# EAGLE schematic bc29_replacement (EAGLE 7.7.0)

## Sheet 1 of 5
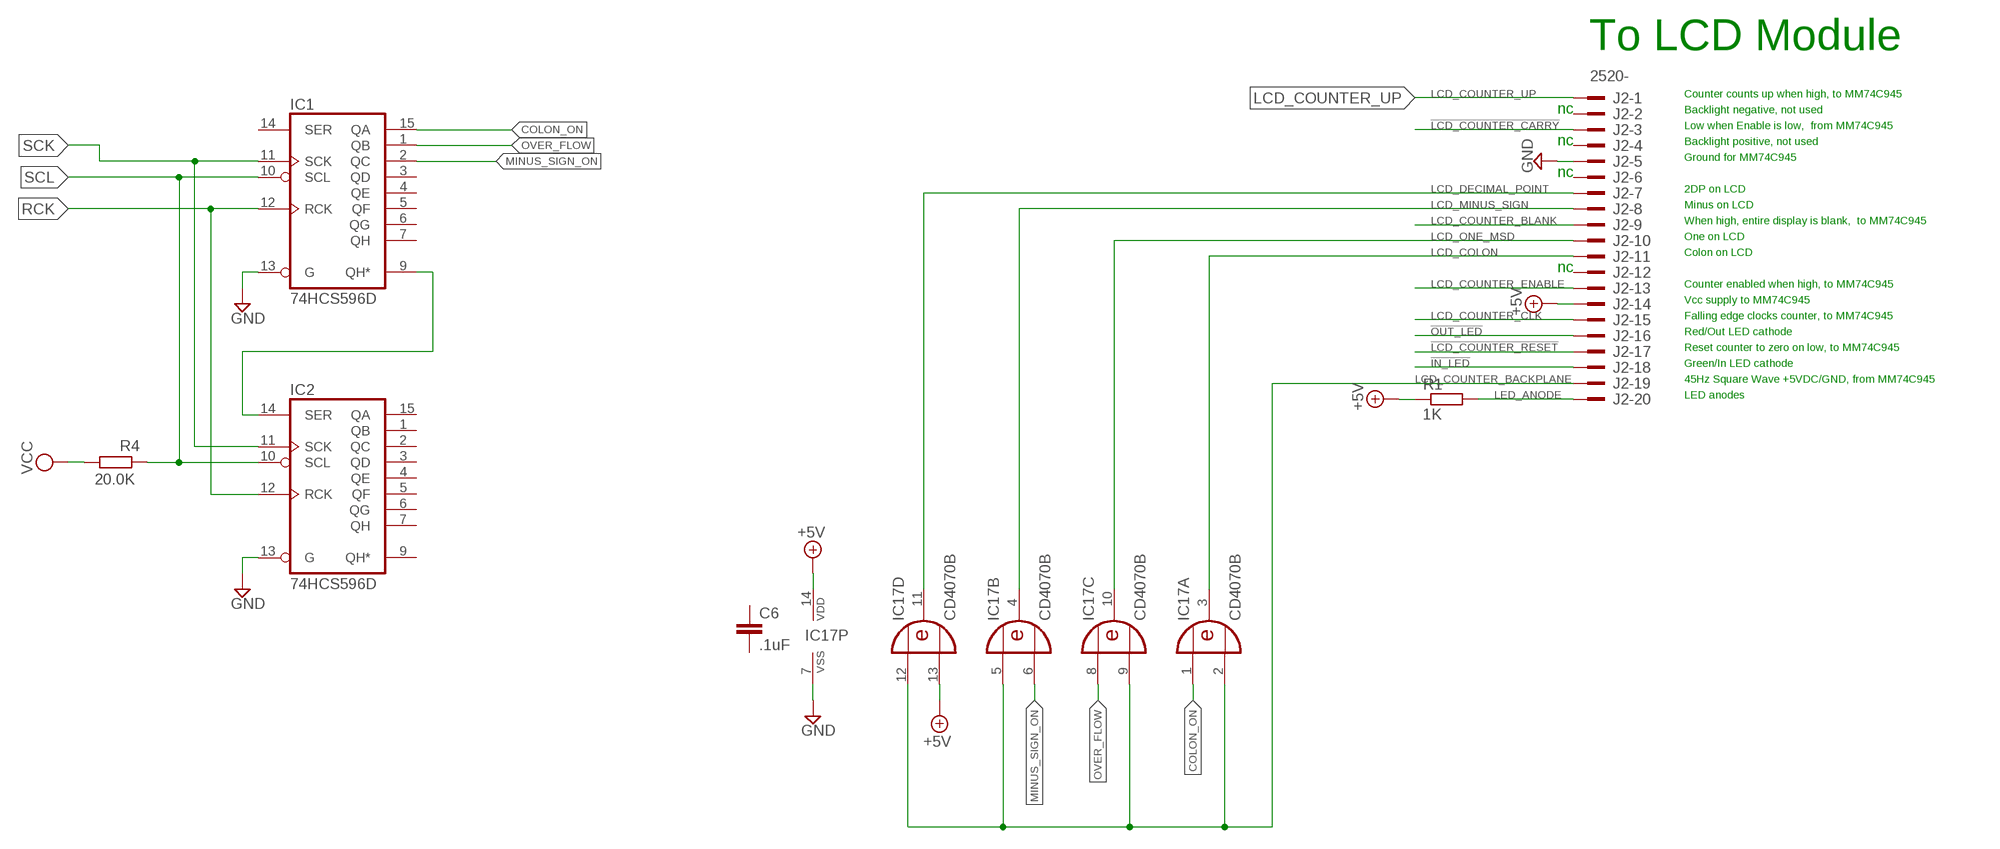
[diagram p0: schematic, sheet 1]

### Parts
C6  .1uF  C-EUC0805  [C0805]
IC1  74HCS596D  74LS596D  [SO16]
IC2  74HCS596D  74LS596D  [SO16]
IC17  CD4070B  4070D  [SO14]
J2  2520-  [PAK100/2500-20]
R1  1K  R-EU_R0805  [R0805]
R4  20.0K  R-EU_R0805  [R0805]

### Nets
!IN_LED: J2.18
!LCD_COUNTER_CARRY: J2.3
!LCD_COUNTER_RESET: J2.17
!OUT_LED: J2.16
+5V: IC17.13(D:I1) J2.14 R1.1 ; also sheet 3
+12V: IC17.14(P:VDD) ; supply symbol labelled +5V
COLON_ON: IC17.1(A:I0)
GND: IC1.13(G) IC2.13(G) IC17.7(P:VSS) J2.5 ; also sheet 2,3,4,5
LCD_COLON: IC17.3(A:O) J2.11
LCD_COUNTER_BACKPLANE: IC17.2(A:I1) IC17.5(B:I0) IC17.9(C:I1) IC17.12(D:I0) J2.19
LCD_COUNTER_BLANK: J2.9
LCD_COUNTER_CLK: J2.15
LCD_COUNTER_ENABLE: J2.13
LCD_COUNTER_UP: J2.1
LCD_DECIMAL_POINT: IC17.11(D:O) J2.7
LCD_MINUS_SIGN: IC17.4(B:O) J2.8
LCD_ONE_MSD: IC17.10(C:O) J2.10
LED_ANODE: J2.20 R1.2
MINUS_SIGN_ON: IC17.6(B:I1)
N$4: IC1.9(QH*) IC2.14(SER)
OVER_FLOW: IC17.8(C:I0)
RCK: IC1.12(RCK) IC2.12(RCK)
SCK: IC1.11(SCK) IC2.11(SCK)
SCL: IC1.10(SCL) IC2.10(SCL) R4.1
VCC: R4.2 ; also sheet 2
Unconnected: C6.1 C6.2 IC1.1(QB) IC1.2(QC) IC1.3(QD) IC1.4(QE) IC1.5(QF) IC1.6(QG) IC1.7(QH) IC1.14(SER) IC1.15(QA) IC2.1(QB) IC2.2(QC) IC2.3(QD) IC2.4(QE) IC2.5(QF) IC2.6(QG) IC2.7(QH) IC2.9(QH*) IC2.15(QA) J2.2 J2.4 J2.6 J2.12

### Notes on the sheet
- To LCD Module
- Counter counts up when high, to MM74C945
- nc | Backlight negative, not used
- Low when Enable is low,  from MM74C945
- nc | Backlight positive, not used
- Ground for MM74C945
- nc
- 2DP on LCD
- Minus on LCD
- When high, entire display is blank,  to MM74C945
- One on LCD
- Colon on LCD
- nc
- Counter enabled when high, to MM74C945
- Vcc supply to MM74C945
- Falling edge clocks counter, to MM74C945
- Red/Out LED cathode
- Reset counter to zero on low, to MM74C945
- Green/In LED cathode
- 45Hz Square Wave +5VDC/GND, from MM74C945
- LED anodes

## Sheet 2 of 5
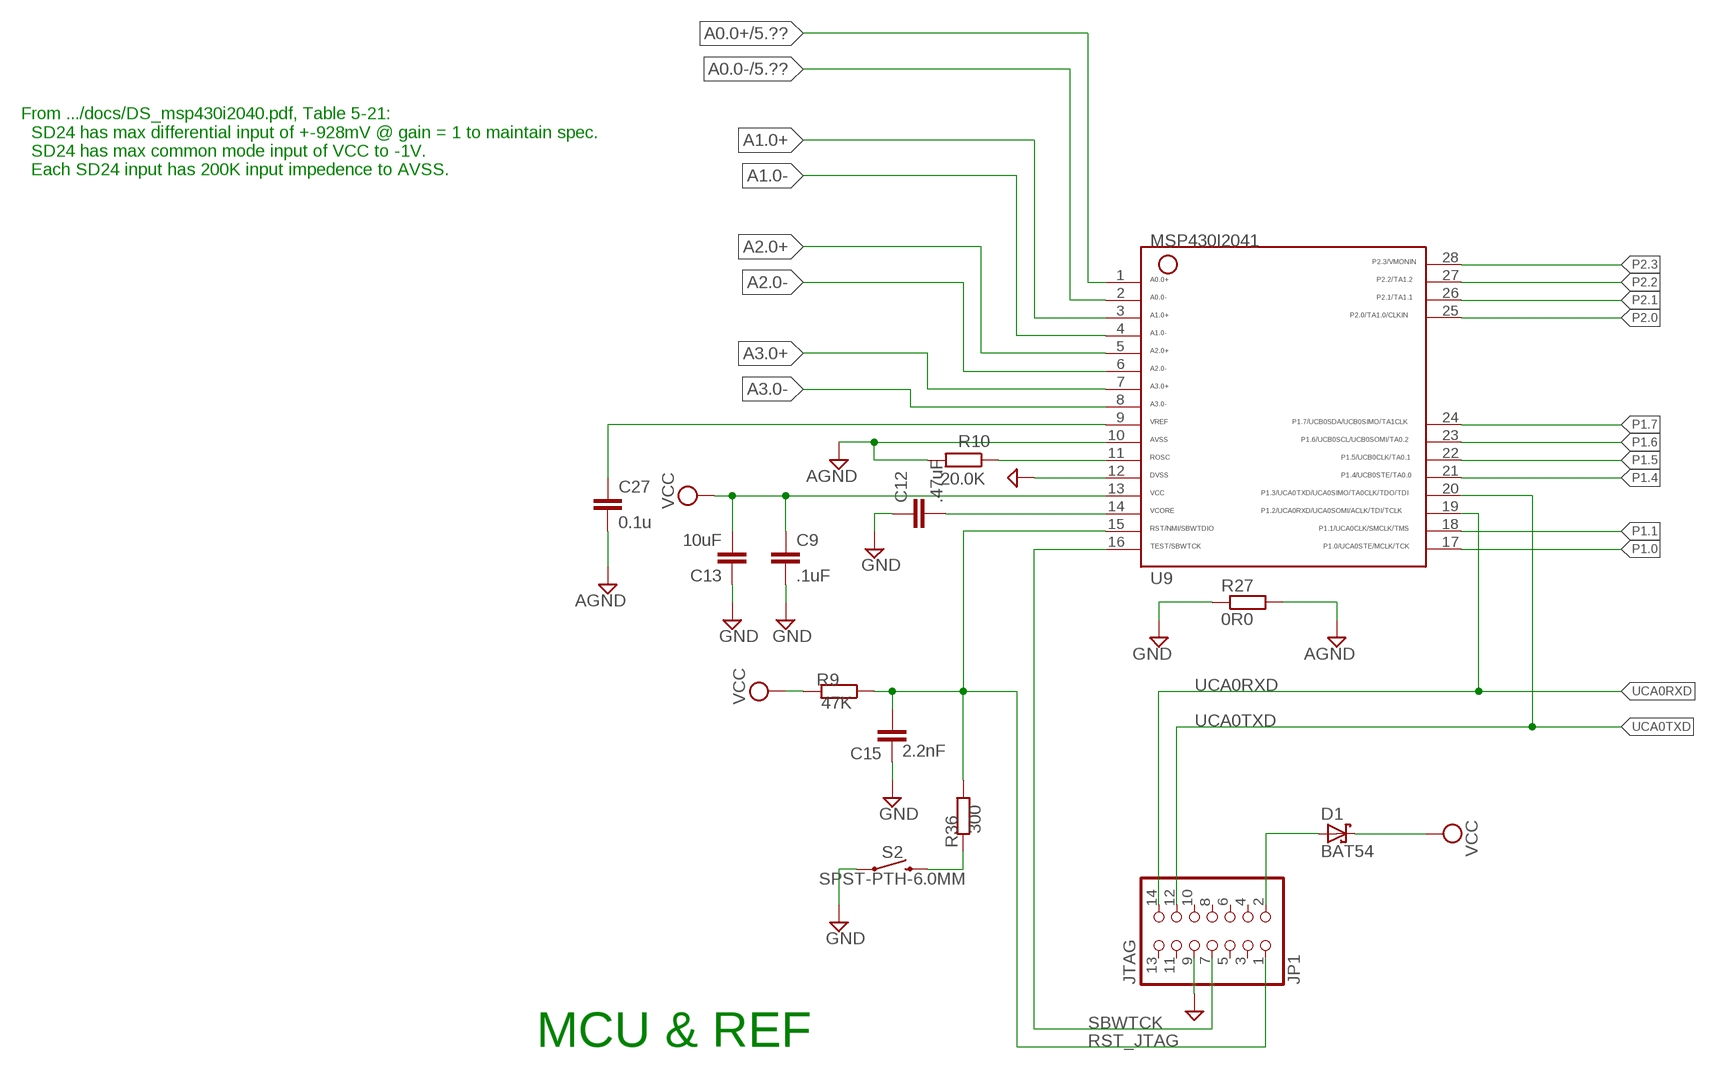
[diagram p1: schematic, sheet 2]

### Parts
C9  .1uF  C-EUC0805  [C0805]
C12  .47uF  C-EUC0805  [C0805]
C13  10uF  C-EUC0805  [C0805]
C15  2.2nF  C-EUC0805  [C0805]
C27  0.1u  CAP-0805  [0805]
D1  BAT54  [SOT23]
JP1  JTAG  PINHD-2X7  [2X07]
R9  47K  R-EU_R0805  [R0805]
R10  20.0K  R-EU_R0805  [R0805]
R27  0R0  R-EU_R0805  [R0805]
R36  300  R-EU_R0805  [R0805]
S2  SPST-PTH-6.0MM  MOMENTARY-SWITCH-SPST-PTH-6.0MM  [TACTILE_SWITCH_PTH_6.0MM]
U9  MSP430I2041TPW  MSP430I204XTPW  [PW28]

### Nets
A0.0+: U9.1 ; also sheet 5
A0.0-: U9.2 ; also sheet 5
A1.0+: U9.3
A1.0-: U9.4
A2.0+: U9.5
A2.0-: U9.6
A3.0+: U9.7
A3.0-: U9.8
AGND: C27.2 R10.2 R27.2 U9.10
GND: C9.2 C12.1 C13.1 C15.1 JP1.9 R27.1 S2.1 U9.12 ; also sheet 1,3,4,5
P1.0: U9.17
P1.1: U9.18
P1.4: U9.21
P1.5: U9.22
P1.6: U9.23
P1.7: U9.24
P2.0: U9.25
P2.1: U9.26
P2.2: U9.27
P2.3: U9.28
ROSC: R10.1 U9.11
RST_JTAG: C15.2 JP1.1 R9.1 R36.1 U9.15
RST_PB: R36.2 S2.3
SBWTCK: JP1.7 U9.16
UCA0RXD: JP1.14 U9.19
UCA0TXD: JP1.12 U9.20
VCC: C9.1 C13.2 D1.3(C) R9.2 U9.13 ; also sheet 1
VCC_JTAG: D1.1(A) JP1.2
VCORE: C12.2 U9.14
VREF: C27.1 U9.9
Unconnected: JP1.3 JP1.4 JP1.5 JP1.6 JP1.8 JP1.10 JP1.11 JP1.13

### Notes on the sheet
- From .../docs/DS_msp430i2040.pdf, Table 5-21:
    SD24 has max differential input of +-928mV @ gain = 1 to maintain spec.
    SD24 has max common mode input of VCC to -1V.
    Each SD24 input has 200K input impedence to AVSS.
- MCU & REF

## Sheet 3 of 5
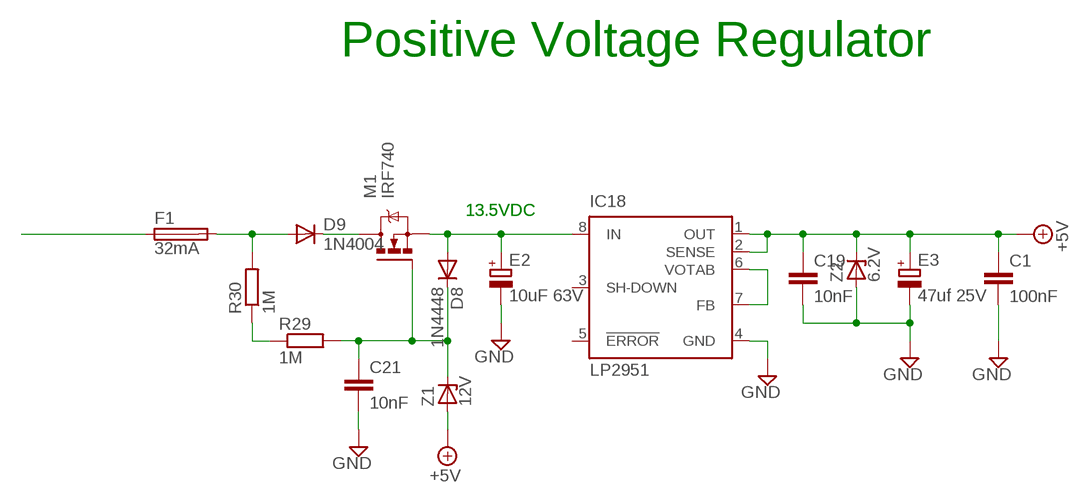
[diagram p2: schematic, sheet 3]

### Parts
C1  100nF  C-EUC1206  [C1206]
C19  10nF  C-EUC0805  [C0805]
C21  10nF  C-EUC0805  [C0805]
D8  1N4448  DIODE-MINIMELF  [MINIMELF]
D9  1N4004  DIODE-SOD80C  [SOD80C]
E2  10uF 63V  CPOL-EUE2.5-5  [E2,5-5]
E3  47uf 25V  CPOL-EUE2.5-5  [E2,5-5]
F1  32mA  FUSEBLANK_5X20MM  [FUSE_HOLDER_5X20MM]
IC18  LP2951  LP2951D  [SO08]
M1  IRF740  [TO220BV]
R29  1M  R-EU_M0805  [M0805]
R30  1M  R-EU_M0805  [M0805]
Z1  12V  ZENER-DIODESOD80C  [SOD80C]
Z2  6.2V  ZENER-DIODESOD80C  [SOD80C]

### Nets
13V5: D8.A E2.+ IC18.8(IN) M1.S
+5V: C1.1 C19.1 E3.+ IC18.1(OUT) IC18.2(SENSE) Z1.A Z2.C ; also sheet 1
+BATT_FILT: F1.1 ; also sheet 4
DRAIN: D9.C M1.D
FUSED_BATT+: D9.A F1.2 R30.2
GATE: C21.1 D8.C M1.G R29.2 Z1.C
GND: C1.2 C19.2 C21.2 E2.- E3.- IC18.4(GND) Z2.A ; also sheet 1,2,4,5
N$29: R29.1 R30.1
N$44: IC18.6(VOTAB) IC18.7(FB)
Unconnected: IC18.3(SH-DOWN) IC18.5(!ERROR)

### Notes on the sheet
- Positive Voltage Regulator
- 13.5VDC | 13.5VDC

## Sheet 4 of 5
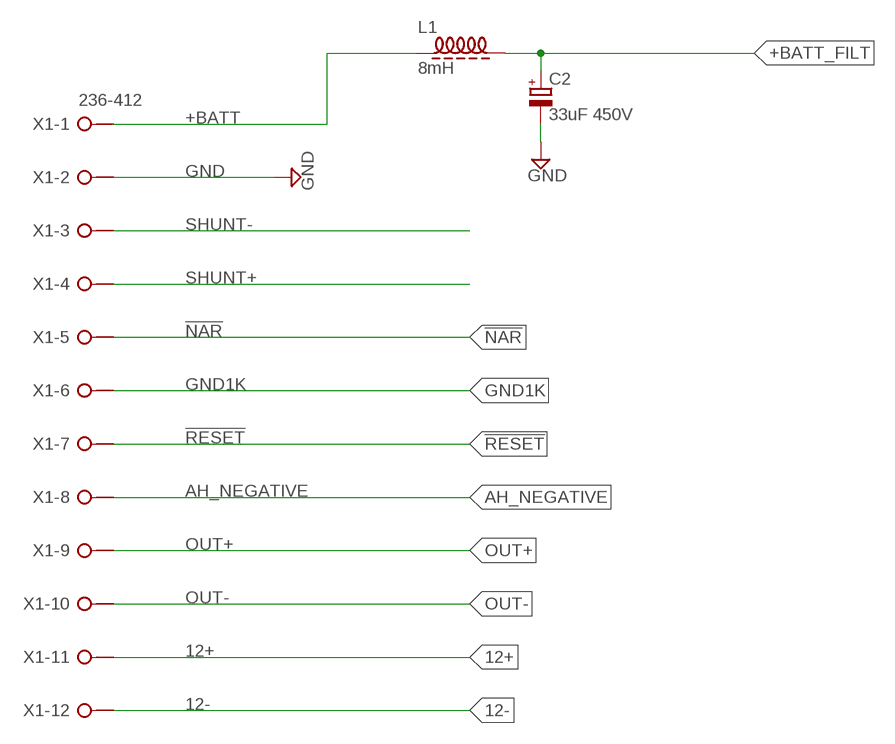
[diagram p3: schematic, sheet 4]

### Parts
C2  33uF 450V  CPOL-EUE7.5-18  [E7,5-18]
L1  8mH  Z14/40CCW  [Z15/4]
X1  236-412  [236-412]

### Nets
12+: X1.11@1(-11:KL1)
12-: X1.12@1(-12:KL1)
!NAR: X1.5@1(-5:KL1)
!RESET: X1.7@1(-7:KL1)
+BATT: L1.1 X1.1@1(-1:KL1)
+BATT_FILT: C2.+ L1.2 ; also sheet 3
AH_NEGATIVE: X1.8@1(-8:KL1)
GND: C2.- X1.2@1(-2:KL1) ; also sheet 1,2,3,5
GND1K: X1.6@1(-6:KL1)
OUT+: X1.9@1(-9:KL1)
OUT-: X1.10@1(-10:KL1)
SHUNT+: X1.4@1(-4:KL1)
SHUNT-: X1.3@1(-3:KL1)
Unconnected: X1.1@2(-1:KL2) X1.2@2(-2:KL2) X1.3@2(-3:KL2) X1.4@2(-4:KL2) X1.5@2(-5:KL2) X1.6@2(-6:KL2) X1.7@2(-7:KL2) X1.8@2(-8:KL2) X1.9@2(-9:KL2) X1.10@2(-10:KL2) X1.11@2(-11:KL2) X1.12@2(-12:KL2)

## Sheet 5 of 5
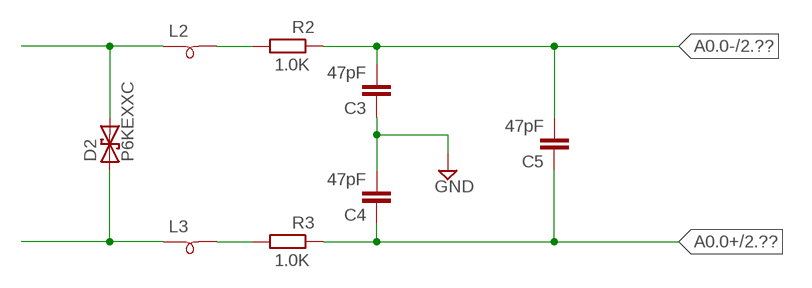
[diagram p4: schematic, sheet 5]

### Parts
C3  47pF  C-EUC0805  [C0805]
C4  47pF  C-EUC0805  [C0805]
C5  47pF  C-EUC0805  [C0805]
D2  P6KEXXC  [CB417-15]
L2  SM-B9  [SM-B9]
L3  SM-B9  [SM-B9]
R2  1.0K  R-EU_R0805  [R0805]
R3  1.0K  R-EU_R0805  [R0805]

### Nets
A0.0+: C4.1 C5.1 R3.1 ; also sheet 2
A0.0-: C3.2 C5.2 R2.1 ; also sheet 2
GND: C3.1 C4.2 ; also sheet 1,2,3,4
N$1: D2.C L2.1
N$2: D2.A L3.1
N$5: L2.2 R2.2
N$8: L3.2 R3.2

## Power pins joined to a net without a drawn wire
GND: IC1.8(GND) IC2.8(GND)
VCC: IC1.16(VCC) IC2.16(VCC)

## Library data of the parts
C1 C3-C6 C9 C12 C13 C15 C19 C21 = rcl:C-EU: CAPACITOR, European symbol
C2 E2 E3 = rcl:CPOL-EU: POLARIZED CAPACITOR, European symbol
C27 = SparkFun-Capacitors:CAP
D1 = diode:BAT54: Schottky Diodes Source: Fairchild .. BAT54.pdf
D2 = diode:P6KEXXC: DIODE transient-voltage suppressor
D8 D9 = diode:DIODE-: DIODE
F1 = fuse:FUSE: Fuse; OC_FARNELL: unknown; OC_NEWARK: unknown
IC1 IC2 = 74xx-us:74*596: 8-bit SHIFT REGISTER, output latch, open collector
IC17 = 40xx:4070: Quad 2-input XOR
IC18 = linear:LP2951: 100 mA, Low Power Low Dropout Voltage Regulator Source: http://www.onsemi.com/pub/Collateral/LP2950-D.PDF
J2 = con-3m:2520-: 3M (TM) Pak 100 4-Wall Header Source: 3M; OC_FARNELL: unknown; OC_NEWARK: unknown
JP1 = pinhead:PINHD-2X7: PIN HEADER
L1 = inductor-neosid:Z?CCW: CHOKE free-suspension choke/nominal inductance winding counter clockwise; OC_FARNELL: unknown; OC_NEWARK: unknown
L2 L3 = inductor-neosid:SM-B: INDUCTOR SMD Bead inductor; OC_FARNELL: unknown; OC_NEWARK: unknown
M1 = transistor-power:IRF740: N-CHANNEL MOS FET
R1-R4 R9 R10 R27 R29 R30 R36 = rcl:R-EU_: RESISTOR, European symbol
S2 = SparkFun-Switches:MOMENTARY-SWITCH-SPST: Momentary Switch (Pushbutton) - SPST Normally-open (NO) SPST momentary switches (buttons, pushbuttons). Variants PTH-12MM - 12mm square, through-hole Momentary Pushbutton Switch - 12mm Square <https://www.sparkfun.com/products/9190> (COM-09190) PTH-6.0MM, PTH-6.0MM-KIT - 6.0mm square, through-hole Mini Pushbutton Switch <https://www.sparkfun.com/products/97> (COM-00097) KIT package intended for soldering kit's - only one side of pads' copper is exposed. PTH-RIGHT-ANGLE-KIT - Right-angle, through-hole Right Angle Tactile Button <https://www.sparkfun.com/products/10791> - Used on SparkFun BigTime Watch Kit <https://www.sparkfun.com/products/11734> SMD-12MM - 12mm square, surface-mount Tactile Button - SMD (12mm) <https://www.sparkfun.com/products/12993> (COM-12993) Used on SparkFun PicoBoard <https://www.sparkfun.com/products/11888> SMD-4.5MM - 4.5mm Square Trackball Switch Used on SparkFun Blackberry Trackballer Breakout <https://www.sparkfun.com/products/13169> SMD-4.6MMX2.8MM - 4.60mm x 2.80mm, surface mount Used on SparkFun Pro Micro - RP2040 <https://www.sparkfun.com/products/17717> SMD-5.2MM, SMD-5.2-REDUNDANT - 5.2mm square, surface-mount Mini Pushbutton Switch - SMD <https://www.sparkfun.com/products/8720> (COM-08720) Used on Arduino Pro Mini <https://www.sparkfun.com/products/11114> REDUNDANT package connects both switch circuits together SMD-6.0X3.5MM - 6.0 x 3.5mm, surface mount Momentary Reset Switch SMD <https://www.sparkfun.com/products/8229> (COM-08229) SMD-6.2MM-TALL - 6.2mm square, surface mount Tactile Button - SMD (6mm) <https://www.sparkfun.com/products/12992> Used on SparkFun Digital Sandbox <https://www.sparkfun.com/products/12651> SMD-RIGHT-ANGLE - Right-angle, surface mount Used on SparkFun Block for Intel® Edison - Arduino <https://www.sparkfun.com/products/13036>; PROD_ID: SWCH-08441; SF_SKU: COM-00097
U9 = TI_MSP430_v16:MSP430I204XTPW: MSP430i204x, MSP430i203x, MSP430i202x Mixed-Signal Microcontrollers, 28-Pin PW Package
X1 = con-wago-508:236-412: Terminal Strips 2.5 mm2/AWG 12, Series 236, Pin Spacings 5/5.08 mm Source: Data sheet <http://www.farnell.com/datasheets/63479.pdf>; MF: Wago Corporation; MPN: 0236-0412; OC_FARNELL: 1283531; OC_NEWARK: 79K2064
Z1 Z2 = diode:ZENER-DIODE: Z-Diode